# EAGLE schematic schip_controle_metingen_BMP280 (EAGLE 9.5.2)
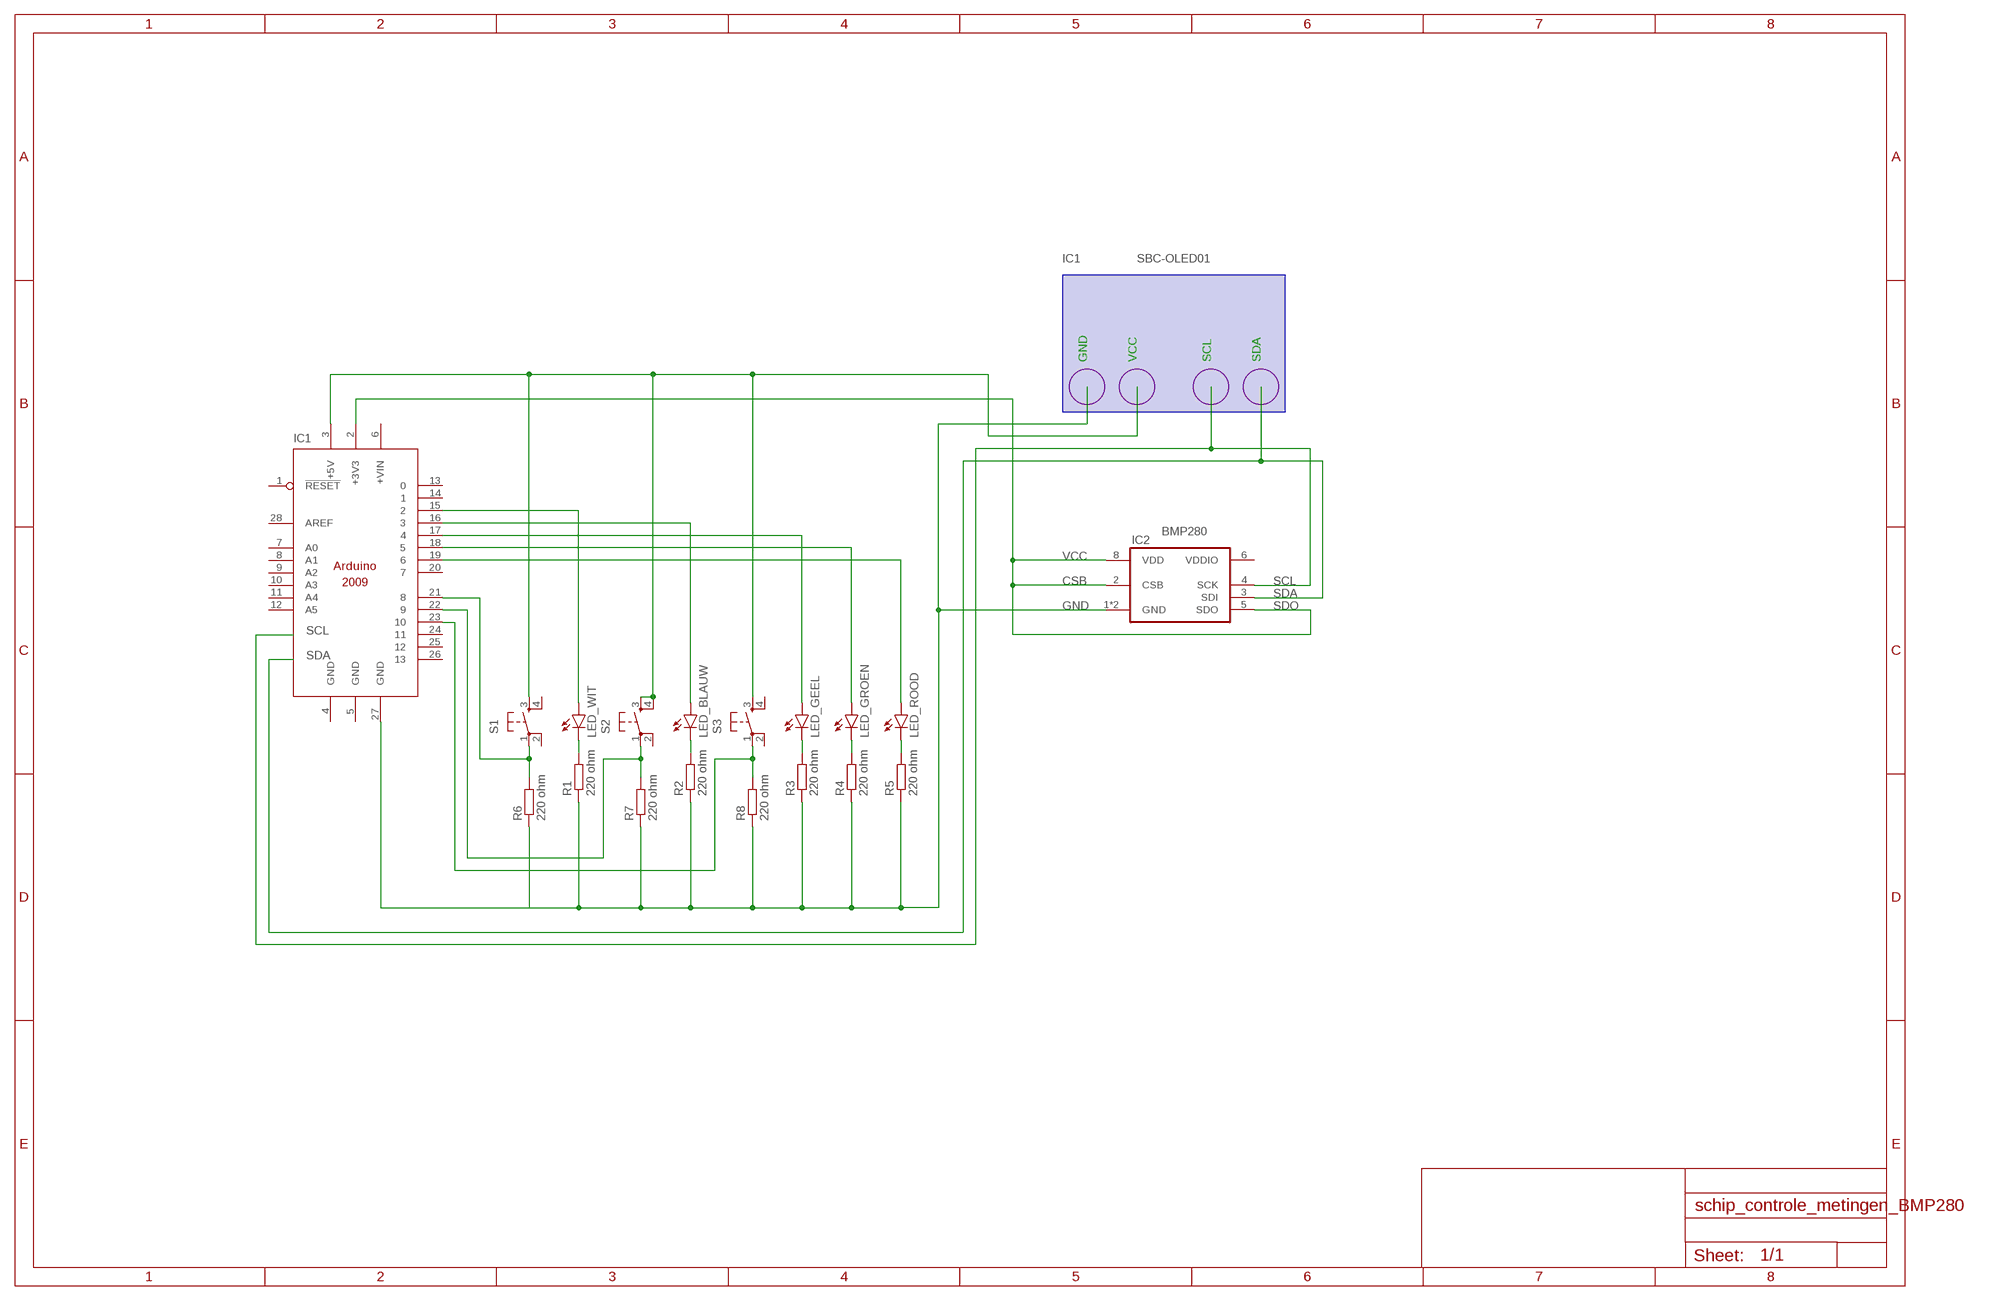
[diagram p0: schematic, sheet 1]

## Parts
IC1  ARDUINO2009_12  [ARDUINO2009_2]
IC2  BMP280  [BMP280]
LED_BLAUW  LED3MM  [LED3MM]
LED_GEEL  LED3MM  [LED3MM]
LED_GROEN  LED3MM  [LED3MM]
LED_ROOD  LED3MM  [LED3MM]
LED_WIT  LED3MM  [LED3MM]
R1  220 ohm  R-EU_0207/10  [0207/10]
R2  220 ohm  R-EU_0207/10  [0207/10]
R3  220 ohm  R-EU_0207/10  [0207/10]
R4  220 ohm  R-EU_0207/10  [0207/10]
R5  220 ohm  R-EU_0207/10  [0207/10]
R6  220 ohm  R-EU_0207/10  [0207/10]
R7  220 ohm  R-EU_0207/10  [0207/10]
R8  220 ohm  R-EU_0207/10  [0207/10]
S1  DTSM-6  [DTSM-6]
S2  DTSM-6  [DTSM-6]
S3  DTSM-6  [DTSM-6]

## Nets
N$2: IC2.3(SDI)
N$3: LED_WIT.K(C) R1.2
N$4: LED_BLAUW.K(C) R2.2
N$5: LED_GEEL.K(C) R3.2
N$6: LED_GROEN.K(C) R4.2
N$7: LED_ROOD.K(C) R5.2
N$8: IC1.21 R6.2 S1.1
N$9: IC1.15 LED_WIT.A
N$10: IC1.22 R7.2 S2.1
N$11: IC1.23 R8.2 S3.1
N$12: IC1.16 LED_BLAUW.A
N$13: IC1.27(GND) IC2.1(GND) IC2.7(GND) R1.1 R2.1 R3.1 R4.1 R5.1 R6.1 R7.1 R8.1
N$14: IC1.3(+5V) S1.3 S2.3 S2.4 S3.3
N$15: IC1.17 LED_GEEL.A
N$16: IC1.18 LED_GROEN.A
N$17: IC1.19 LED_ROOD.A
N$21: IC2.4(SCK)
N$25: IC1.2(+3V3) IC2.2(CSB) IC2.5(SDO) IC2.8(VDD)
Unconnected: IC1.1(!RESET) IC1.6(+VIN) IC1.7(A0) IC1.8(A1) IC1.9(A2) IC1.10(A3) IC1.11(A4) IC1.12(A5) IC1.13 IC1.14 IC1.20 IC1.24 IC1.25 IC1.26 IC1.28(AREF) S1.2 S1.4 S2.2 S3.2 S3.4

## Notes on the sheet
- IC1 | SBC-OLED01
- GND | VCC | SCL | SDA
- BMP280
- VCC
- CSB | SCL
- SDA
- GND | SDO
- SCL
- SDA

## Power pins joined to a net without a drawn wire
GND: IC1.4(GND) IC1.5(GND)
VDDIO: IC2.6(VDDIO)

## Library data of the parts
IC1 = arduino:ARDUINO2009_1: The Arduino Duemilanove ("2009") is a microcontroller board based on the ATmega168 or ATmega328. - 14 digital input/output pins (of which 6 can be used as PWM outputs) - 6 analog inputs, a 16 MHz crystal oscillator - USB connection - power jack - ISP header - reset button It contains everything needed to support the microcontroller; simply connect it to a computer with a USB cable or power it with a AC-to-DC adapter or battery to get started http://arduino.cc/en/Main/ArduinoBoardDuemilanove
IC2 = bosch-bmp280:BMP280: The BMP280 is an absolute barometric pressure sensor especially designed for mobile applications. The sensor module is housed in an extremely compact 8-pin metal-lid LGA package with a footprint of only 2.0 × 2.5 mm2 and 0.95 mm package height. Its small dimensions and its low power consumption of 2.7 μA @1Hz allow the implementation in battery driven devices such as mobile phones, GPS modules or watches. The library has been designed by Richard Magdycz <https://www.facebook.com/groups/eaglecadsoftUK>
LED_BLAUW LED_GEEL LED_GROEN LED_ROOD LED_WIT = led:LED: LED OSRAM: - CHIPLED LG R971, LG N971, LY N971, LG Q971, LY Q971, LO R971, LY R971 LH N974, LH R974 LS Q976, LO Q976, LY Q976 LO Q996 - Hyper CHIPLED LW Q18S LB Q993, LB Q99A, LB R99A - SideLED LS A670, LO A670, LY A670, LG A670, LP A670 LB A673, LV A673, LT A673, LW A673 LH A674 LY A675 LS A676, LA A676, LO A676, LY A676, LW A676 LS A679, LY A679, LG A679 - Hyper Micro SIDELED® LS Y876, LA Y876, LO Y876, LY Y876 LT Y87S - SmartLED LW L88C, LW L88S LB L89C, LB L89S, LG L890 LS L89K, LO L89K, LY L89K LS L896, LA L896, LO L896, LY L896 - TOPLED LS T670, LO T670, LY T670, LG T670, LP T670 LSG T670, LSP T670, LSY T670, LOP T670, LYG T670 LG T671, LOG T671, LSG T671 LB T673, LV T673, LT T673, LW T673 LH T674 LS T676, LA T676, LO T676, LY T676, LB T676, LH T676, LSB T676, LW T676 LB T67C, LV T67C, LT T67C, LS T67K, LO T67K, LY T67K, LW E67C LS E67B, LA E67B, LO E67B, LY E67B, LB E67C, LV E67C, LT E67C LW T67C LS T679, LY T679, LG T679 LS T770, LO T770, LY T770, LG T770, LP T770 LB T773, LV T773, LT T773, LW T773 LH T774 LS E675, LA E675, LY E675, LS T675 LS T776, LA T776, LO T776, LY T776, LB T776 LHGB T686 LT T68C, LB T68C - Hyper Mini TOPLED® LB M676 - Mini TOPLED Santana® LG M470 LS M47K, LO M47K, LY M47K Source: http://www.osram.convergy.de LUXEON: - LUMILED® LXK2-PW12-R00, LXK2-PW12-S00, LXK2-PW14-U00, LXK2-PW14-V00 LXK2-PM12-R00, LXK2-PM12-S00, LXK2-PM14-U00 LXK2-PE12-Q00, LXK2-PE12-R00, LXK2-PE12-S00, LXK2-PE14-T00, LXK2-PE14-U00 LXK2-PB12-K00, LXK2-PB12-L00, LXK2-PB12-M00, LXK2-PB14-N00, LXK2-PB14-P00, LXK2-PB14-Q00 LXK2-PR12-L00, LXK2-PR12-M00, LXK2-PR14-Q00, LXK2-PR14-R00 LXK2-PD12-Q00, LXK2-PD12-R00, LXK2-PD12-S00 LXK2-PH12-R00, LXK2-PH12-S00 LXK2-PL12-P00, LXK2-PL12-Q00, LXK2-PL12-R00 Source: www.luxeon.com KINGBRIGHT: KA-3528ASYC Source: www.kingbright.com
R1-R8 = rcl:R-EU_: RESISTOR, European symbol; SPICEPREFIX: R
S1-S3 = switch-tact:DTSM-6